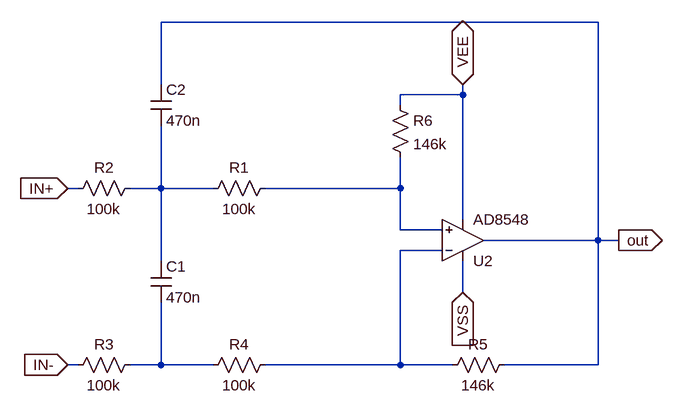
[diagram p0: schematic voltmod_op.asc]
voltmod_op.asc, the LTspice schematic file:
Version 4
SHEET 1 880 680
WIRE 640 -176 -32 -176
WIRE -32 -80 -32 -176
WIRE 432 -64 432 -80
WIRE 432 -64 336 -64
WIRE 336 -48 336 -64
WIRE -160 80 -176 80
WIRE -32 80 -32 -16
WIRE -32 80 -80 80
WIRE 48 80 -32 80
WIRE 336 80 336 32
WIRE 336 80 128 80
WIRE 432 128 432 -64
WIRE 336 144 336 80
WIRE 400 144 336 144
WIRE 640 160 640 -176
WIRE 640 160 464 160
WIRE 672 160 640 160
WIRE 400 176 336 176
WIRE -32 192 -32 80
WIRE 432 240 432 192
WIRE -160 352 -176 352
WIRE -32 352 -32 256
WIRE -32 352 -80 352
WIRE 48 352 -32 352
WIRE 336 352 336 176
WIRE 336 352 128 352
WIRE 416 352 336 352
WIRE 640 352 640 160
WIRE 640 352 496 352
FLAG 432 -80 VEE
IOPIN 432 -80 BiDir
FLAG 432 240 VSS
IOPIN 432 240 In
FLAG -176 80 IN+
IOPIN -176 80 In
FLAG -176 352 IN-
IOPIN -176 352 In
FLAG 672 160 out
IOPIN 672 160 Out
DATAFLAG 240 80 ""
SYMBOL res 144 336 R90
WINDOW 0 0 56 VBottom 2
WINDOW 3 32 56 VTop 2
SYMATTR InstName R4
SYMATTR Value 100k
SYMBOL cap -48 192 R0
SYMATTR InstName C1
SYMATTR Value 470n
SYMBOL res 512 336 R90
WINDOW 0 0 56 VBottom 2
WINDOW 3 32 56 VTop 2
SYMATTR InstName R5
SYMATTR Value 146k
SYMBOL res 144 64 R90
WINDOW 0 0 56 VBottom 2
WINDOW 3 32 56 VTop 2
SYMATTR InstName R1
SYMATTR Value 100k
SYMBOL res -64 64 R90
WINDOW 0 0 56 VBottom 2
WINDOW 3 32 56 VTop 2
SYMATTR InstName R2
SYMATTR Value 100k
SYMBOL res -64 336 R90
WINDOW 0 0 56 VBottom 2
WINDOW 3 32 56 VTop 2
SYMATTR InstName R3
SYMATTR Value 100k
SYMBOL cap -48 -80 R0
SYMATTR InstName C2
SYMATTR Value 470n
SYMBOL res 320 -64 R0
SYMATTR InstName R6
SYMATTR Value 146k
SYMBOL OpAmps\\AD8548 432 224 M180
SYMATTR InstName U2

The netlist it stands for:
* voltmod_op.asc
R4 N003 N004 100k
C1 N001 N004 470n
R5 out N003 146k
R1 N002 N001 100k
R2 N001 IN+ 100k
R3 N004 IN- 100k
C2 out N001 470n
R6 VEE N002 146k
XU2 N002 N003 VSS VEE out AD8548  ; pins In+ In- V+ V- OUT
.backanno
.end